# Altium schematic sheet Sheet1.SchDoc
size B; SheetNumber: 1
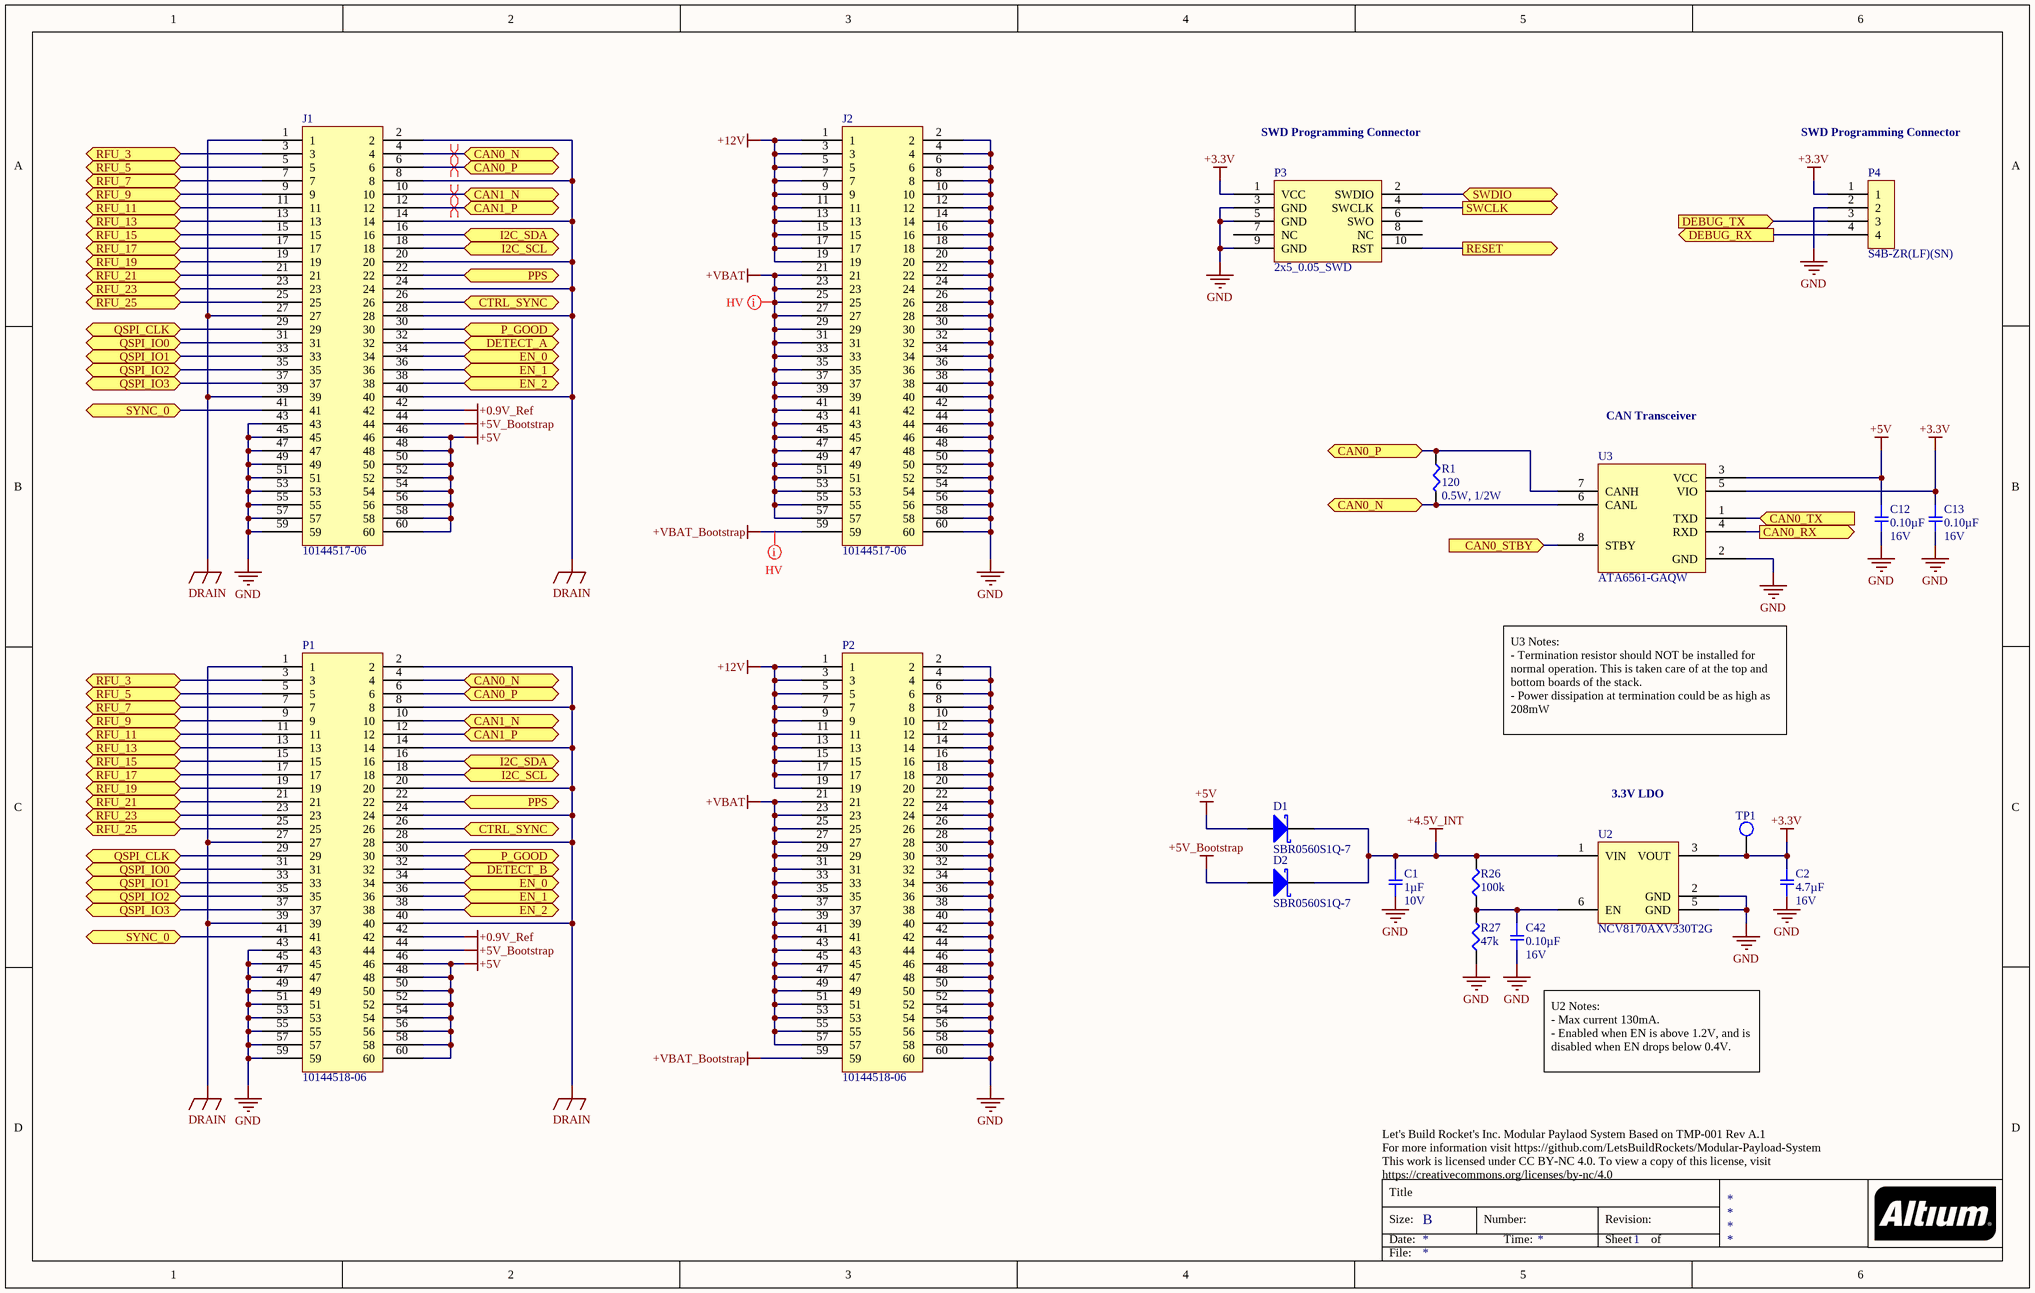
[diagram p0: Sheet1.SchDoc]

## Parts
C1  1µF  Voltage: 10V  [SMD-0402C]
C2  4.7µF  Voltage: 16V  [SMD-0805C]
C12  0.10µF  Voltage: 16V  [SMD-0402C]
C13  0.10µF  Voltage: 16V  [SMD-0402C]
C42  0.10µF  Voltage: 16V  [SMD-0402C]
D1  SBR0560S1Q-7  [SOD123]
D2  SBR0560S1Q-7  [SOD123]
J1  10144517-06  [10144517-062802LF]
J2  10144517-06  [10144517-062802LF]
P1  10144518-06  [10144518-064802LF]
P2  10144518-06  [10144518-064802LF]
P3  2x5_0.05_SWD  [2x5_0.05_R]
P4  S4B-ZR(LF)(SN)  [S4B-ZR(LF)(SN)]
R1  120  Power (Watts): 0.5W, 1/2W  [SMD-0805-RES]
R26  100k  [SMD-0402-RES]
R27  47k  [SMD-0402-RES]
TP1  TP  [TP_SMD_40]  (value not drawn)  (no BOM)
U2  NCV8170AXV330T2G  [SOTFL50P160X60-6N]
U3  ATA6561-GAQW  [SOIC127P600X175-8N]

## Ports
CAN0_N (bidir), CAN0_P (bidir), CAN0_RX (out), CAN0_STBY (in), CAN0_TX (in), CAN1_N (bidir), CAN1_P (bidir), CTRL_SYNC (bidir), DEBUG_RX (out), DEBUG_TX (in), DETECT_A (bidir), DETECT_B (bidir), EN_0 (bidir), EN_1 (bidir), EN_2 (bidir), I2C_SCL (bidir), I2C_SDA (bidir), P_GOOD (bidir), PPS (bidir), QSPI_CLK (bidir), QSPI_IO0 (bidir), QSPI_IO1 (bidir), QSPI_IO2 (bidir), QSPI_IO3 (bidir), RESET (out), RFU_3 (bidir), RFU_5 (bidir), RFU_7 (bidir), RFU_9 (bidir), RFU_11 (bidir), RFU_13 (bidir), RFU_15 (bidir), RFU_17 (bidir), RFU_19 (bidir), RFU_21 (bidir), RFU_23 (bidir), RFU_25 (bidir), SWCLK (out), SWDIO (bidir), SYNC_0 (bidir)

## Nets
+0.9V_Ref: J1.42 P1.42
+3.3V: C2.2 C13.1 P3.1(VCC) P4.1 TP1.1 U2.3(VOUT) U3.5(VIO)
+4.5V_INT: C1.2 D1.K D2.K R26.2 U2.1(VIN)
+5V: C12.1 D1.A J1.46 J1.48 J1.50 J1.52 J1.54 J1.56 J1.58 J1.60 P1.46 P1.48 P1.50 P1.52 P1.54 P1.56 P1.58 P1.60 U3.3(VCC)
+5V_Bootstrap: D2.A J1.44 P1.44
+12V: J2.1 J2.3 J2.5 J2.7 J2.9 J2.11 J2.13 J2.15 J2.17 J2.19 P2.1 P2.3 P2.5 P2.7 P2.9 P2.11 P2.13 P2.15 P2.17 P2.19
+VBAT: J2.21 J2.23 J2.25 J2.27 J2.29 J2.31 J2.33 J2.35 J2.37 J2.39 J2.41 J2.43 J2.45 J2.47 J2.49 J2.51 J2.53 J2.55 J2.57 P2.21 P2.23 P2.25 P2.27 P2.29 P2.31 P2.33 P2.35 P2.37 P2.39 P2.41 P2.43 P2.45 P2.47 P2.49 P2.51 P2.53 P2.55 P2.57
+VBAT_Bootstrap: J2.59 P2.59
DRAIN: J1.1 J1.2 J1.8 J1.14 J1.20 J1.24 J1.27 J1.28 J1.39 J1.40 P1.1 P1.2 P1.8 P1.14 P1.20 P1.24 P1.27 P1.28 P1.39 P1.40
GND: C1.1 C2.1 C12.2 C13.2 C42.2 J1.43 J1.45 J1.47 J1.49 J1.51 J1.53 J1.55 J1.57 J1.59 J2.2 J2.4 J2.6 J2.8 J2.10 J2.12 J2.14 J2.16 J2.18 J2.20 J2.22 J2.24 J2.26 J2.28 J2.30 J2.32 J2.34 J2.36 J2.38 J2.40 J2.42 J2.44 J2.46 J2.48 J2.50 J2.52 J2.54 J2.56 J2.58 J2.60 P1.43 P1.45 P1.47 P1.49 P1.51 P1.53 P1.55 P1.57 P1.59 P2.2 P2.4 P2.6 P2.8 P2.10 P2.12 P2.14 P2.16 P2.18 P2.20 P2.22 P2.24 P2.26 P2.28 P2.30 P2.32 P2.34 P2.36 P2.38 P2.40 P2.42 P2.44 P2.46 P2.48 P2.50 P2.52 P2.54 P2.56 P2.58 P2.60 P3.3(GND) P3.5(GND) P3.9(GND) P4.2 R27.1 U2.2(GND) U2.5(GND) U3.2(GND)
CAN0_N: J1.4 P1.4 R1.2 U3.6(CANL) ; port CAN0_N
CAN0_P: J1.6 P1.6 R1.1 U3.7(CANH) ; port CAN0_P
CAN0_RX: U3.4(RXD) ; port CAN0_RX
CAN0_STBY: U3.8(STBY) ; port CAN0_STBY
CAN0_TX: U3.1(TXD) ; port CAN0_TX
CAN1_N: J1.10 P1.10 ; port CAN1_N
CAN1_P: J1.12 P1.12 ; port CAN1_P
CTRL_SYNC: J1.26 P1.26 ; port CTRL_SYNC
DEBUG_RX: P4.4 ; port DEBUG_RX
DEBUG_TX: P4.3 ; port DEBUG_TX
DETECT_A: J1.32 ; port DETECT_A
DETECT_B: P1.32 ; port DETECT_B
EN_0: J1.34 P1.34 ; port EN_0
EN_1: J1.36 P1.36 ; port EN_1
EN_2: J1.38 P1.38 ; port EN_2
I2C_SCL: J1.18 P1.18 ; port I2C_SCL
I2C_SDA: J1.16 P1.16 ; port I2C_SDA
P_GOOD: J1.30 P1.30 ; port P_GOOD
PPS: J1.22 P1.22 ; port PPS
QSPI_CLK: J1.29 P1.29 ; port QSPI_CLK
QSPI_IO0: J1.31 P1.31 ; port QSPI_IO0
QSPI_IO1: J1.33 P1.33 ; port QSPI_IO1
QSPI_IO2: J1.35 P1.35 ; port QSPI_IO2
QSPI_IO3: J1.37 P1.37 ; port QSPI_IO3
RESET: P3.10(RST) ; port RESET
RFU_3: J1.3 P1.3 ; port RFU_3
RFU_5: J1.5 P1.5 ; port RFU_5
RFU_7: J1.7 P1.7 ; port RFU_7
RFU_9: J1.9 P1.9 ; port RFU_9
RFU_11: J1.11 P1.11 ; port RFU_11
RFU_13: J1.13 P1.13 ; port RFU_13
RFU_15: J1.15 P1.15 ; port RFU_15
RFU_17: J1.17 P1.17 ; port RFU_17
RFU_19: J1.19 P1.19 ; port RFU_19
RFU_21: J1.21 P1.21 ; port RFU_21
RFU_23: J1.23 P1.23 ; port RFU_23
RFU_25: J1.25 P1.25 ; port RFU_25
SWCLK: P3.4(SWCLK) ; port SWCLK
SWDIO: P3.2(SWDIO) ; port SWDIO
SYNC_0: J1.41 P1.41 ; port SYNC_0
NetC42_1: C42.1 R26.1 R27.2 U2.6(EN)

Not connected (* = marked no-connect by the designer): P3 6(SWO) 7(NC) 8(NC)

## Layout directives
differential pair: CAN0_N, CAN0_P, CAN1_N, CAN1_P
net class HIghVoltage: +VBAT, +VBAT_Bootstrap

## Notes on the sheet
- SWD Programming Connector
- CAN Transceiver
- U3 Notes:
  - Termination resistor should NOT be installed for normal operation. This is taken care of at the top and bottom boards of the stack.
  - Power dissipation at termination could be as high as 208mW
- 3.3V LDO
- (near C42) U2 Notes:
  - Max current 130mA.
  - Enabled when EN is above 1.2V, and is disabled when EN drops below 0.4V.
- Let's Build Rocket's Inc. Modular Paylaod System Based on TMP-001 Rev A.1
  For more information visit https://github.com/LetsBuildRockets/Modular-Payload-System
  This work is licensed under CC BY-NC 4.0. To view a copy of this license, visit https://creativecommons.org/licenses/by-nc/4.0
- Title
- Size:
- Date:
- B
- Number:
- Time:
- Revision:
- Sheet
- of
- File:

## Library data of the parts
C1 = GCM155C71A105KE38D: CAP CER 1UF 10V X7S 0402; Manufacturer: Murata Electronics North America; Factory Stock: 0; Unit Price (USD): 0.12; Minimum Quantity: 1; Tolerance: ±10%; Datasheets: http://www.murata.com/~/media/webrenewal/support/library/catalog/products/capacitor/mlcc/c03e.ashx; Image: //media.digikey.com/Renders/Murata%20Renders/ZRB-SERIES-0402.jpg; Digi-Key Part Number: 490-13409-1-ND; Part Number: GCM155C71A105KE38D; Quantity Available: 7240; @ qty: 0; Packaging: Cut Tape (CT); Series: GCM; Part Status: Active; Value: 1µF; Temperature Coefficient: X7S; Operating Temperature: -55°C ~ 125°C; Features: -; Ratings: AEC-Q200; Applications: Automotive; Mounting Type: Surface Mount, MLCC; Package / Case: 0402 (1005 Metric); Size / Dimension: 0.039" L x 0.020" W (1.00mm x 0.50mm); Height - Seated (Max): -; Thickness (Max): 0.022" (0.55mm); Lead Spacing: -; Lead Style: -
C2 = GCJ21BR71C475KA01L: CAP CER 4.7UF 16V X7R 0805; Manufacturer: Murata Electronics North America; Factory Stock: 0; Unit Price (USD): 0.44; Minimum Quantity: 1; Tolerance: ±10%; Datasheets: http://www.murata.com/~/media/webrenewal/support/library/catalog/products/capacitor/mlcc/c03e.ashx; Image: //media.digikey.com/Renders/Murata%20Renders/0805%20(2012%20Metric)%20.85mm.jpg; Digi-Key Part Number: 490-10557-1-ND; Part Number: GCJ21BR71C475KA01L; Quantity Available: 53217; @ qty: 0; Packaging: Cut Tape (CT); Series: GCJ; Part Status: Active; Value: 4.7µF; Temperature Coefficient: X7R; Operating Temperature: -55°C ~ 125°C; Features: Soft Termination; Ratings: AEC-Q200; Applications: Automotive, Boardflex Sensitive; Mounting Type: Surface Mount, MLCC; Package / Case: 0805 (2012 Metric); Size / Dimension: 0.079" L x 0.049" W (2.00mm x 1.25mm); Height - Seated (Max): -; Thickness (Max): 0.057" (1.45mm); Lead Spacing: -; Lead Style: -
C12 C13 C42 = GCM155R71C104KA55D: CAP CER 0.1UF 16V X7R 0402; Manufacturer: Murata Electronics North America; Factory Stock: 0; Unit Price (USD): 0.1; Minimum Quantity: 1; Tolerance: ±10%; Datasheets: http://www.murata.com/~/media/webrenewal/support/library/catalog/products/capacitor/mlcc/c03e.ashx; Image: //media.digikey.com/Renders/Murata%20Renders/ZRB-SERIES-0402.jpg; Digi-Key Part Number: 490-4759-1-ND; Part Number: GCM155R71C104KA55D; Quantity Available: 734194; @ qty: 0; Packaging: Cut Tape (CT); Series: GCM; Part Status: Active; Value: 0.10µF; Temperature Coefficient: X7R; Operating Temperature: -55°C ~ 125°C; Features: -; Ratings: AEC-Q200; Applications: Automotive; Mounting Type: Surface Mount, MLCC; Package / Case: 0402 (1005 Metric); Size / Dimension: 0.039" L x 0.020" W (1.00mm x 0.50mm); Height - Seated (Max): -; Thickness (Max): 0.022" (0.55mm); Lead Spacing: -; Lead Style: -
R1 = ERJ-P6WJ121V: RES SMD 120 OHM 5% 1/2W 0805; Manufacturer: Panasonic Electronic Components; Factory Stock: 0; Unit Price (USD): 0.08237; @ qty: 1500; Minimum Quantity: 1; Temperature Coefficient: ±200ppm/°C; Part Number: ERJ-P6WJ121V; Datasheets: https://industrial.panasonic.com/cdbs/www-data/pdf/RDA0000/AOA0000C243.pdf; Image: //media.digikey.com/Renders/Panasonic%20Renders/ERJ-0805%20Pkg.jpg; Digi-Key Part Number: P16943CT-ND; Quantity Available: 4133; Packaging: Cut Tape (CT); Series: ERJ; Part Status: Active; Value: 120; Tolerance: ±5%; Composition: Thick Film; Features: Automotive AEC-Q200, Pulse Withstanding; Operating Temperature: -55°C ~ 155°C; Package / Case: 0805 (2012 Metric); Supplier Device Package: 0805; Size / Dimension: 0.079" L x 0.049" W (2.00mm x 1.25mm); Height - Seated (Max): 0.030" (0.75mm); Number of Terminations: 2; Failure Rate: -
R26 = ERJ-2GEJ104X: RES SMD 100K OHM 5% 1/10W 0402; Manufacturer: Panasonic Electronic Components; Factory Stock: 0; Unit Price (USD): 0.00350; @ qty: 1500; Minimum Quantity: 1; Power (Watts): 0.1W, 1/10W; Temperature Coefficient: ±200ppm/°C; Part Number: ERJ-2GEJ104X; Datasheets: http://industrial.panasonic.com/www-cgi/jvcr13pz.cgi?E+PZ+3+AOA0001+ERJ2GEJ104X+7+WW; Image: //media.digikey.com/Photos/Panasonic%20Photos/ERJ-PA2-Series.jpg; Digi-Key Part Number: P100KJCT-ND; Quantity Available: 2387986; Packaging: Cut Tape (CT); Series: ERJ; Part Status: Active; Value: 100k; Tolerance: ±5%; Composition: Thick Film; Features: Automotive AEC-Q200; Operating Temperature: -55°C ~ 155°C; Package / Case: 0402 (1005 Metric); Supplier Device Package: 0402; Size / Dimension: 0.039" L x 0.020" W (1.00mm x 0.50mm); Height - Seated (Max): 0.016" (0.40mm); Number of Terminations: 2; Failure Rate: -
R27 = ERJ-2GEJ473X: RES SMD 47K OHM 5% 1/10W 0402; Manufacturer: Panasonic Electronic Components; Factory Stock: 0; Unit Price (USD): 0.00350; @ qty: 1500; Minimum Quantity: 1; Power (Watts): 0.1W, 1/10W; Temperature Coefficient: ±200ppm/°C; Part Number: ERJ-2GEJ473X; Datasheets: http://industrial.panasonic.com/www-cgi/jvcr13pz.cgi?E+PZ+3+AOA0001+ERJ2GEJ473X+7+WW; Image: //media.digikey.com/Photos/Panasonic%20Photos/ERJ-PA2-Series.jpg; Digi-Key Part Number: P47KJCT-ND; Quantity Available: 5182645; Packaging: Cut Tape (CT); Series: ERJ; Part Status: Active; Value: 47k; Tolerance: ±5%; Composition: Thick Film; Features: Automotive AEC-Q200; Operating Temperature: -55°C ~ 155°C; Package / Case: 0402 (1005 Metric); Supplier Device Package: 0402; Size / Dimension: 0.039" L x 0.020" W (1.00mm x 0.50mm); Height - Seated (Max): 0.016" (0.40mm); Number of Terminations: 2; Failure Rate: -